# Altium schematic sheet MotorDriver.SchDoc
size A4; SheetNumber: 1; SheetTotal: 1
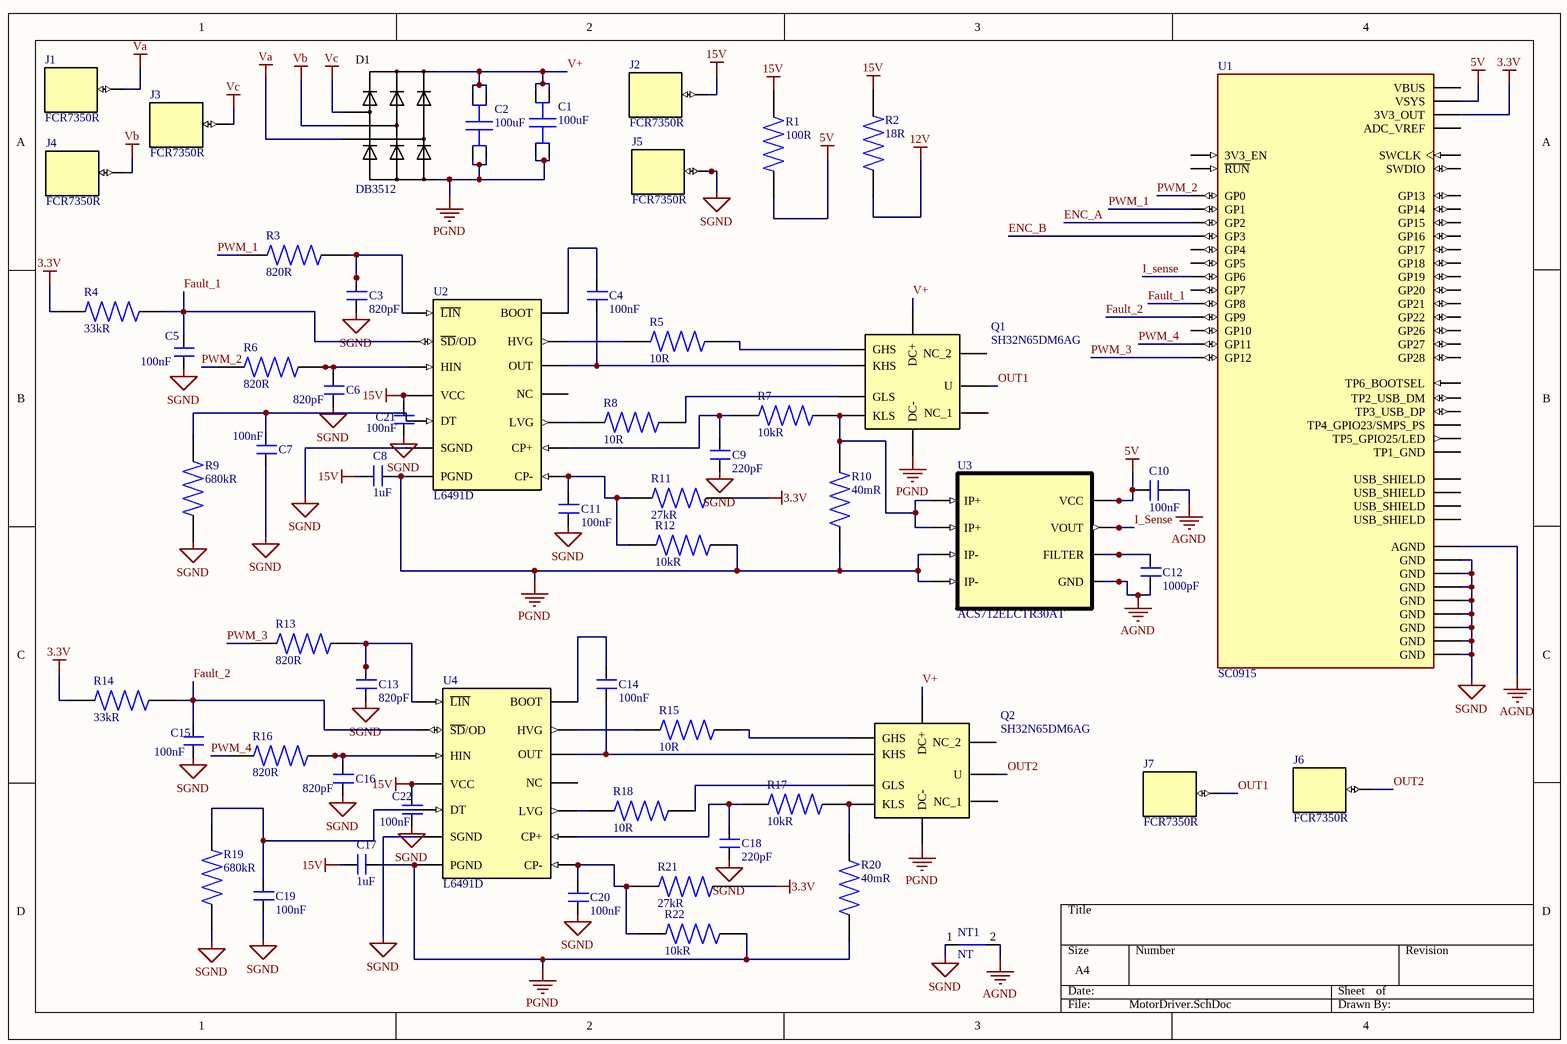
[diagram p0: MotorDriver.SchDoc]

## Parts
C1  100uF  [EZPV60107MTS]
C2  100uF  [EZPV60107MTS]
C3  820pF  [GRM0335C1E821JA01D]
C4  100nF  [C1812W104KDRACTU]
C5  100nF  [CC0805KRX7R9BB104]
C6  820pF  [GRM0335C1E821JA01D]
C7  100nF  [CC0805KRX7R9BB104]
C8  1uF  [CC0603KRX5R8BB105]
C9  220pF  [C0402C221K8RACTU]
C10  100nF  [CC0805KRX7R9BB104]
C11  100nF  [CC0805KRX7R9BB104]
C12  1000pF  [C0603C102K5RACTU]
C13  820pF  [GRM0335C1E821JA01D]
C14  100nF  [C1812W104KDRACTU]
C15  100nF  [CC0805KRX7R9BB104]
C16  820pF  [GRM0335C1E821JA01D]
C17  1uF  [CC0603KRX5R8BB105]
C18  220pF  [C0402C221K8RACTU]
C19  100nF  [CC0805KRX7R9BB104]
C20  100nF  [CC0805KRX7R9BB104]
C21  100nF  [CC0805KRX7R9BB104]
C22  100nF  [CC0805KRX7R9BB104]
D1  DB3512  [3PhaseBridge]
J1  FCR7350R  [FCR7350]
J2  FCR7350R  [FCR7350]
J3  FCR7350R  [FCR7350]
J4  FCR7350R  [FCR7350]
J5  FCR7350R  [FCR7350]
J6  FCR7350R  [FCR7350]
J7  FCR7350R  [FCR7350]
NT1  NT  [NetTie]  (net tie)
Q1  SH32N65DM6AG  [SH32N65DM6AG]
Q2  SH32N65DM6AG  [SH32N65DM6AG]
R1  100R  [RQ73C2B100RBTD]
R2  18R  [CRGP2010F18R]
R3  820R  [RMCF0603FT820R]
R4  33kR  [ERA-3AEB333V]
R5  10R  [CRCW060310R0FKEAHP]
R6  820R  [RMCF0603FT820R]
R7  10kR  [RES_ERJ2RKF1002X]
R8  10R  [CRCW060310R0FKEAHP]
R9  680kR  [ERJ-3EKF6802V]
R10  40mR  [PWR163S-25-R040JE]
R11  27kR  [RC0805JR-0727KL]
R12  10kR  [RES_ERJ2RKF1002X]
R13  820R  [RMCF0603FT820R]
R14  33kR  [ERA-3AEB333V]
R15  10R  [CRCW060310R0FKEAHP]
R16  820R  [RMCF0603FT820R]
R17  10kR  [RES_ERJ2RKF1002X]
R18  10R  [CRCW060310R0FKEAHP]
R19  680kR  [ERJ-3EKF6802V]
R20  40mR  [PWR163S-25-R040JE]
R21  27kR  [RC0805JR-0727KL]
R22  10kR  [RES_ERJ2RKF1002X]
U1  SC0915  [MODULE_SC0915]
U2  L6491D  [SOIC127P600X175-14N]
U3  ACS712ELCTR30AT  [currentsensor]
U4  L6491D  [SOIC127P600X175-14N]

## Nets
3.3V: R4.2 R11.1 R14.2 R21.1 U1.36(3V3_OUT)
5V: C10.1 R1.1 U1.39(VSYS) U3.8(VCC)
12V: R2.1
15V: C8.2 C17.2 C21.2 C22.2 J2.P$1 R1.2 R2.2 U2.4(VCC) U4.4(VCC)
AGND: C10.2 C12.1 NT1.2 U1.33(AGND) U3.5(GND)
PGND: C1.1 C1.3 C2.1 C2.3 C8.1 C17.1 D1.5(-) Q1.8(DC-) Q2.8(DC-) R10.1 R12.2 R20.1 R22.2 U2.7(PGND) U3.3(IP-) U3.4(IP-) U4.7(PGND)
SGND: C3.1 C5.1 C6.1 C7.1 C9.1 C11.1 C13.1 C15.1 C16.1 C18.1 C19.1 C20.1 C21.1 C22.1 J5.P$1 NT1.1 R9.1 R19.1 U1.3(GND) U1.8(GND) U1.13(GND) U1.18(GND) U1.23(GND) U1.28(GND) U1.38(GND) U1.D2(GND) U2.6(SGND) U4.6(SGND)
Va: D1.3 J1.P$1
Vb: D1.2 J4.P$1
Vc: D1.1 J3.P$1
ENC_A: U1.4(GP2)
ENC_B: U1.5(GP3)
Fault_1: C5.2 R4.1 U1.11(GP8) U2.2(~{SD}/OD)
Fault_2: C15.2 R14.1 U1.12(GP9) U4.2(~{SD}/OD)
I_Sense: U1.9(GP6) U3.7(VOUT)
OUT1: J7.P$1 Q1.7(U)
OUT2: J6.P$1 Q2.7(U)
PWM_1: R3.1 U1.2(GP1)
PWM_2: R6.1 U1.1(GP0)
PWM_3: R13.1 U1.16(GP12)
PWM_4: R16.1 U1.15(GP11)
V+: C1.2 C1.4 C2.2 C2.4 D1.4(+) Q1.9(DC+) Q2.9(DC+)
NetC3_2: C3.2 R3.2 U2.1(~{LIN})
NetC4_1: C4.1 Q1.2(KHS) U2.12(OUT)
NetC4_2: C4.2 U2.14(BOOT)
NetC6_2: C6.2 R6.2 U2.3(HIN)
NetC7_2: C7.2 R9.2 U2.5(DT)
NetC9_2: C9.2 R7.1 U2.10(CP+)
NetC11_2: C11.2 R11.2 R12.1 U2.9(CP-)
NetC12_2: C12.2 U3.6(FILTER)
NetC13_2: C13.2 R13.2 U4.1(~{LIN})
NetC14_1: C14.1 Q2.2(KHS) U4.12(OUT)
NetC14_2: C14.2 U4.14(BOOT)
NetC16_2: C16.2 R16.2 U4.3(HIN)
NetC18_2: C18.2 R17.1 U4.10(CP+)
NetC19_2: C19.2 R19.2 U4.5(DT)
NetC20_2: C20.2 R21.2 R22.1 U4.9(CP-)
NetQ1_1: Q1.1(GHS) R5.2
NetQ1_5: Q1.5(KLS) R7.2 R10.2 U3.1(IP+) U3.2(IP+)
NetQ1_6: Q1.6(GLS) R8.2
NetQ2_1: Q2.1(GHS) R15.2
NetQ2_5: Q2.5(KLS) R17.2 R20.2
NetQ2_6: Q2.6(GLS) R18.2
NetR5_1: R5.1 U2.13(HVG)
NetR8_1: R8.1 U2.8(LVG)
NetR15_1: R15.1 U4.13(HVG)
NetR18_1: R18.1 U4.8(LVG)

Not connected (* = marked no-connect by the designer): Q1 3(NC_1) 4(NC_2); Q2 3(NC_1) 4(NC_2); U1 6(GP4) 7(GP5) 10(GP7) 14(GP10) 17(GP13) 19(GP14) 20(GP15) 21(GP16) 22(GP17) 24(GP18) 25(GP19) 26(GP20) 27(GP21) 29(GP22) 30(~{RUN}) 31(GP26) 32(GP27) 34(GP28) 35(ADC_VREF) 37(3V3_EN) 40(VBUS) A(USB_SHIELD) B(USB_SHIELD) C(USB_SHIELD) D(USB_SHIELD) D1(SWCLK) D3(SWDIO) TP1(TP1_GND) TP2(TP2_USB_DM) TP3(TP3_USB_DP) TP4(TP4_GPIO23/SMPS_PS) TP5(TP5_GPIO25/LED) TP6(TP6_BOOTSEL); U2 11(NC); U4 11(NC)

## Library data of the parts
C1 C2 = EZP-V60107MTS: CAP FILM 100UF 10% 600V RADIAL; Manufacturer_Name: Panasonic; Datasheet Link: http://industrial.panasonic.com/cdbs/www-data/pdf/RDL0000/RDL0000C251.pdf; Height: 52.5mm; Manufacturer_Part_Number: EZP-V60107MTS; Mouser Part Number: 667-EZP-V60107MTS; Mouser Price/Stock: https://www.mouser.co.uk/ProductDetail/Panasonic/EZP-V60107MTS?qs=OlC7AqGiEDk7%2FzfxM6wGiA%3D%3D
C3 C6 C13 C16 = GRM0335C1E821JA01D: CAP CER 820PF 25V C0G/NP0 0201; MF: Murata Electronics; SnapEDA_Link: https://www.snapeda.com/parts/GRM0335C1E821JA01D/Murata+Electronics+North+America/view-part/?ref=snap; Package: 0603 Murata; Value: *; MP: GRM0335C1E821JA01D; Check_prices: https://www.snapeda.com/parts/GRM0335C1E821JA01D/Murata+Electronics+North+America/view-part/?ref=eda
C4 C14 = C1812W104KDRACTU: CAP CER 0.1UF 1KV X7R 1812; Package: None; Price: None; Value: *; MP: C1812W104KDRACTU; Availability: Unavailable
C5 C7 C10 C11 C15 C19-C22 = CC0805KRX7R9BB104: CAP CER 0.1UF 50V X7R 0805; MF: Yageo; Value: *; Availability: Unavailable; SnapEDA_Link: https://www.snapeda.com/parts/CC0805KRX7R9BB104/Yageo/view-part/105548/?ref=snap; Package: 0805 Yageo; MP: CC0805KRX7R9BB104; Price: None
C8 C17 = CC0603KRX5R8BB105: CAP CER 1UF 25V X5R 0603; MF: Yageo; SnapEDA_Link: https://www.snapeda.com/parts/CC0603KRX5R8BB105/Yageo/view-part/1820893/?ref=snap; Package: 0603 Yageo; Price: None; Value: *; MP: CC0603KRX5R8BB105; Availability: Unavailable
C9 C18 = C0402C221K8RACTU: CAP CER 220PF 10V X7R 0402; MF: {'manufacturer': u'KEMET'}; Package: None; Price: None; Value: *; MP: C0402C221K8RACTU; Availability: Unavailable
C12 = C0603C102K5RACTU: CAP CER 1000PF 50V X7R 0603; MF: KEMET; SnapEDA_Link: https://www.snapeda.com/parts/C0603C102K5RACTU/KEMET/view-part/319836/?ref=snap; Price: None; Availability: Unavailable; Value: *; MP: C0603C102K5RACTU; Package: 0603 Kemet
D1 = DB35-12: BRIDGE RECT 3P 1.2KV 35A DB-35; ki_keywords: Bridge 3 phase; ki_description: Bridge_3_phase; Datasheet: https://diotec.com/de/produktliste/B3.html
J1-J7 = FCR7350R: Banana Jack Connector Standard Banana Solder Red; MF: Cliff; SnapEDA_Link: https://www.snapeda.com/parts/FCR7350R/Cliff+Electronics/view-part/?ref=snap; Package: None; Value: *; MP: FCR7350R; Check_prices: https://www.snapeda.com/parts/FCR7350R/Cliff+Electronics/view-part/?ref=eda
NT1 = NetTie: Net Tie
Q1 Q2 = SH32N65DM6AG: MOSFET 2N-CH 650V 32A 9ACEPACK; Manufacturer_Name: STMicroelectronics; Geometry.Height: 5.75mm; Manufacturer_Part_Number: SH32N65DM6AG; Mouser Part Number: 511-SH32N65DM6AG; Mouser Price/Stock: https://www.mouser.co.uk/ProductDetail/STMicroelectronics/SH32N65DM6AG?qs=By6Nw2ByBD04Okf4gmqE1g%3D%3D; Arrow Part Number: *; Arrow Price/Stock: *; Datasheet Link: https://www.st.com/resource/en/datasheet/sh32n65dm6ag.pdf
R1 = RQ73C2B100RBTD: RES 100 OHMS 0.1% 0.4W 1206; Package: None; Price: None; Value: *; MP: RQ73C2B100RBTD; Availability: Unavailable
R2 = CRGP2010F18R: RES 18 OHM 1% 1.25W 2010; Package: None; Price: None; Value: *; MP: CRGP2010F18R; Availability: Unavailable
R3 R6 R13 R16 = RMCF0603FT820R: RES 820 OHM 1% 1/10W 0603; MF: Stackpole Electronics Inc; Digi-Key_Part_Number: RMCF0603FT820RCT-ND; SnapEDA_Link: https://www.snapeda.com/parts/RMCF0603FT820R/Stackpole%20Electronics%20Inc/view-part/3955492/?ref=snap; DigiKey-Purchase-URL: https://snapeda.com/shop?store=DigiKey&id=3955492; MP: RMCF0603FT820R; Package: 1508 Stackpole; Value: *
R4 R14 = ERA3AEB333V: RES SMD 33K OHM 0.1% 1/10W 0603; Package: None; MP: ERA3AEB333V; Price: None; Availability: Unavailable; Value: *
R5 R8 R15 R18 = CRCW060310R0FKEAHP: RES SMD 10 OHM 1% 1/3W 0603; MF: Vishay Dale; MP: CRCW060310R0FKEAHP; Digi-Key_Part_Number: 541-10.0SCT-ND; Package: 1608 Vishay; SnapEDA_Link: https://www.snapeda.com/parts/CRCW060310R0FKEAHP/Vishay%20Dale/view-part/132114/?ref=snap; DigiKey-Purchase-URL: https://snapeda.com/shop?store=DigiKey&id=132114; Value: *
R7 R12 R17 R22 = ERJ2RKF1002X: RES SMD 10K OHM 1% 1/10W 0402; MF: Panasonic; MP: ERJ-2RKF1002X; Package: 1005-2 Panasonic; Price: None; Check_prices: https://www.snapeda.com/parts/ERJ-2RKF1002X/Panasonic%20Electronic%20Components/view-part/78636/?ref=eda; Value: *; SnapEDA_Link: https://www.snapeda.com/parts/ERJ-2RKF1002X/Panasonic%20Electronic%20Components/view-part/78636/?ref=snap; Availability: In Stock
R9 R19 = ERJ3EKF6802V: RES SMD 68K OHM 1% 1/10W 0603; Value: *; MP: ERJ3EKF6802V; Availability: Unavailable; Price: None; Package: None
R10 R20 = PWR163S-25-R040JE: RES 0.04 OHM 5% 25W DPAK; Manufacturer: Bourns; Package: None; Price: None; Value: *; MP: PWR163S-25-R040JE; Availability: Unavailable; Supplier: Arrow Electronics; Supplier Part Number: PWR163S-25-R040JE; Manufacturer Part Number: PWR163S-25-R040JE; RoHS: No; Category: Chip SMD Resistors; Pricing: 1000=1,752, 2000=1,735, 2500=1,719, 3000=1,703, 4000=1,686, 5000=1,67, 10000=1,656 (USD); ComponentLink1URL: https://datasheet.ciiva.com:443/pdfs/VipMasterIC/IC/BOUR/BOUR-S-A0002274294/BOUR-S-A0002274294-1.pdf?src-supplier=IHS+Markit; ComponentLink1Description: https://datasheet.ciiva.com:443/pdfs/VipMasterIC/IC/BOUR/BOUR-S-A0002274294/BOUR-S-A0002274294-1.pdf?src-supplier=IHS+Markit; ComponentLink2URL: https://datasheet.ciiva.com/29508/pwr163-29508342.pdf?src-supplier=Digikey; ComponentLink2Description: https://datasheet.ciiva.com/29508/pwr163-29508342.pdf?src-supplier=Digikey
R11 R21 = RC0805JR-0727KL: RES 27K OHM 5% 1/8W 0805; Manufacturer: Bourns; MP: PWR163S-25-R040JE; Package: None; Price: None; Value: *; Availability: Unavailable; Supplier: Arrow Electronics; Supplier Part Number: PWR163S-25-R040JE; Manufacturer Part Number: PWR163S-25-R040JE; RoHS: No; Category: Chip SMD Resistors; Pricing: 1000=1,752, 2000=1,735, 2500=1,719, 3000=1,703, 4000=1,686, 5000=1,67, 10000=1,656 (USD); ComponentLink1URL: https://datasheet.ciiva.com:443/pdfs/VipMasterIC/IC/BOUR/BOUR-S-A0002274294/BOUR-S-A0002274294-1.pdf?src-supplier=IHS+Markit; ComponentLink1Description: https://datasheet.ciiva.com:443/pdfs/VipMasterIC/IC/BOUR/BOUR-S-A0002274294/BOUR-S-A0002274294-1.pdf?src-supplier=IHS+Markit; ComponentLink2URL: https://datasheet.ciiva.com/29508/pwr163-29508342.pdf?src-supplier=Digikey; ComponentLink2Description: https://datasheet.ciiva.com/29508/pwr163-29508342.pdf?src-supplier=Digikey
U1 = SC0915: RP2040 Raspberry Pi Pico - ARM® Cortex®-M0+ MCU 32-Bit Embedded Evaluation Board; SnapEDA_Link: https://www.snapeda.com/parts/SC0915/Raspberry+Pi/view-part/?ref=snap; Availability: In Stock; Package: None; Price: None; MP: SC0915; Check_prices: https://www.snapeda.com/parts/SC0915/Raspberry+Pi/view-part/?ref=eda; MF: Raspberry Pi; Value: *; Purchase-URL: https://pricing.snapeda.com/search/part/SC0915/?ref=eda
U2 U4 = L6491D: IC GATE DRVR HALF-BRIDGE 14SO; Manufacturer_Name: STMicroelectronics; Datasheet Link: http://www.mouser.com/datasheet/2/389/l6491-974060.pdf; Height: 1.75mm; Manufacturer_Part_Number: L6491D; Mouser Part Number: 511-L6491D; Mouser Price/Stock: https://www.mouser.co.uk/ProductDetail/STMicroelectronics/L6491D?qs=WHlX%252B%252B9%2FRwCiXa20eeUAEg%3D%3D; Arrow Part Number: L6491D; Arrow Price/Stock: https://www.arrow.com/en/products/l6491d/stmicroelectronics?region=nac
U3 = ACS712ELCTR30AT: SENSOR CURRENT HALL 30A AC/DC; MP: ACS712ELCTR-30A-T; MF: Allegro; Price: None; Availability: In Stock; Package: SOIC-8 Allegro MicroSystems LLC; SnapEDA_Link: https://www.snapeda.com/parts/ACS712ELCTR-30A-T/Allegro+Industries/view-part/?ref=snap; Check_prices: https://www.snapeda.com/parts/ACS712ELCTR-30A-T/Allegro+Industries/view-part/?ref=eda; Value: *; Purchase-URL: https://pricing.snapeda.com/search/part/ACS712ELCTR-30A-T/?ref=eda